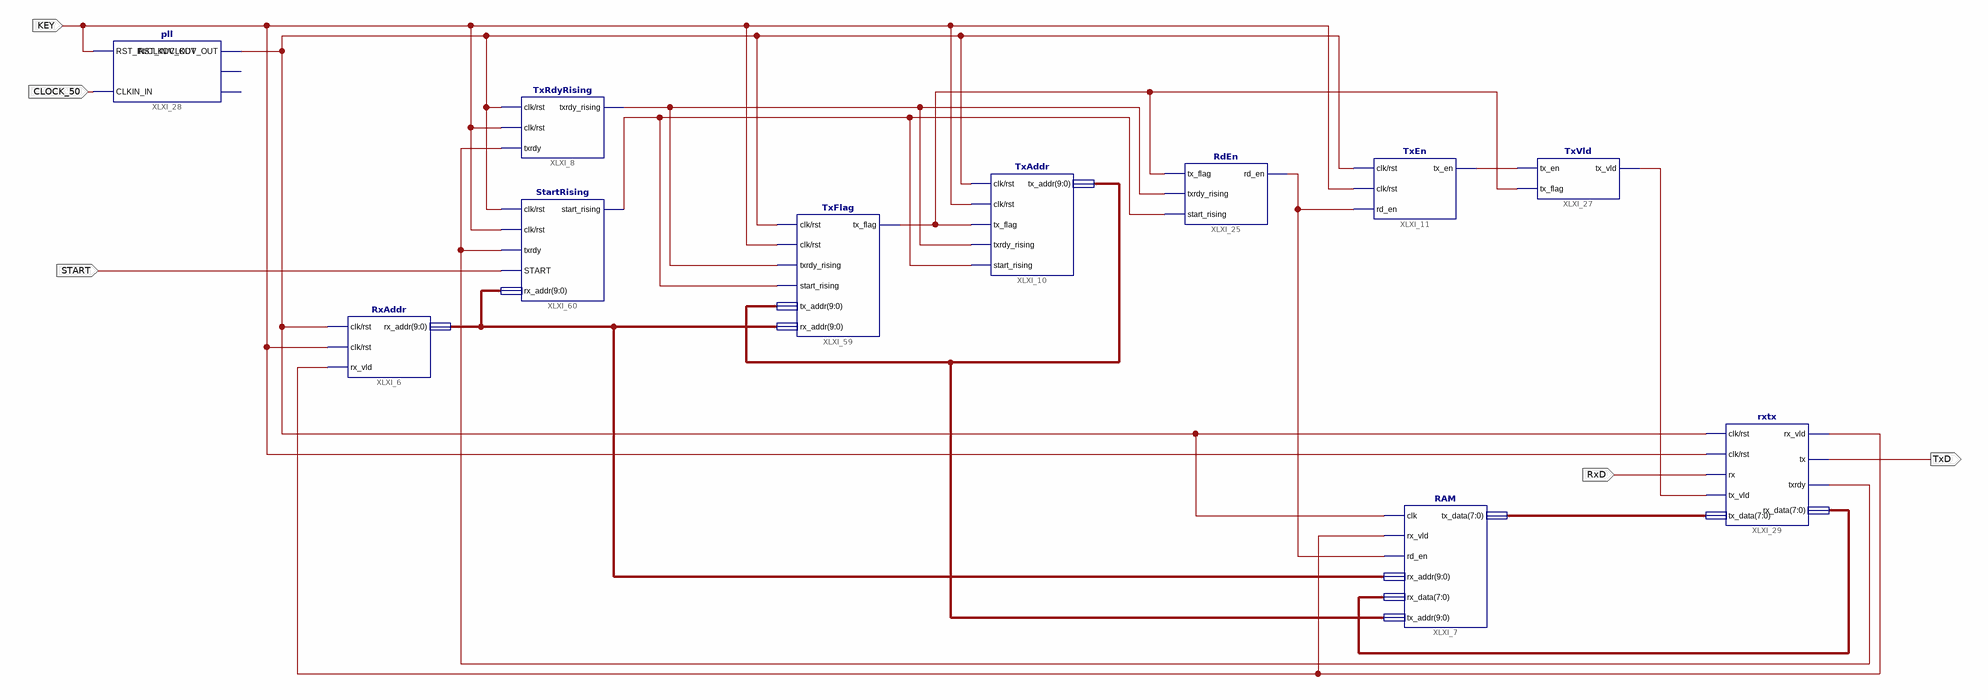
[diagram p0: schematic sheet 1]
// Xilinx ISE schematic uart_x_top.sch (spartan3e) as structural Verilog: 11 symbols, 5 ports
module uart_x_top (
  input  CLOCK_50,
  input  KEY,
  input  START,
  input  RxD,
  output TxD
);

  wire XLXN_12, XLXN_41, XLXN_81, XLXN_87, XLXN_88, XLXN_102, XLXN_172, XLXN_177;
  wire [7:0] XLXN_100, XLXN_108;
  wire [9:0] XLXN_1, XLXN_94;

  TxEn XLXI_11 (.clk(KEY), .rst(KEY), .rd_en(XLXN_87), .tx_en(XLXN_88));
  TxAddr XLXI_10 (
    .clk(KEY), .rst(KEY), .tx_flag(XLXN_177), .txrdy_rising(XLXN_172), .start_rising(XLXN_81),
    .tx_addr(XLXN_94));
  RdEn XLXI_25 (.tx_flag(XLXN_177), .txrdy_rising(XLXN_172), .start_rising(XLXN_81), .rd_en(XLXN_87));
  TxVld XLXI_27 (.tx_en(XLXN_88), .tx_flag(XLXN_177), .tx_vld(XLXN_102));
  pll XLXI_28 (.RST_IN(KEY), .CLKIN_IN(CLOCK_50), .CLKDV_OUT(KEY));  // open: CLKIN_IBUFG_OUT, CLK0_OUT
  RxAddr XLXI_6 (.clk(KEY), .rst(KEY), .rx_vld(XLXN_12), .rx_addr(XLXN_1));
  RAM XLXI_7 (
    .clk(KEY), .rd_en(XLXN_87), .rx_vld(XLXN_12), .rx_data(XLXN_100), .rx_addr(XLXN_1), .tx_addr(XLXN_94),
    .tx_data(XLXN_108));
  TxRdyRising XLXI_8 (.clk(KEY), .rst(KEY), .txrdy(XLXN_41), .txrdy_rising(XLXN_172));
  TxFlag XLXI_59 (
    .clk(KEY), .rst(KEY), .txrdy_rising(XLXN_172), .start_rising(XLXN_81), .tx_addr(XLXN_94),
    .rx_addr(XLXN_1), .tx_flag(XLXN_177));
  StartRising XLXI_60 (.clk(KEY), .rst(KEY), .txrdy(XLXN_41), .START(START), .rx_addr(XLXN_1), .start_rising(XLXN_81));
  rxtx XLXI_29 (
    .clk(KEY), .rst(KEY), .rx(RxD), .tx_vld(XLXN_102), .tx_data(XLXN_108), .rx_vld(XLXN_12), .tx(TxD),
    .txrdy(XLXN_41), .rx_data(XLXN_100));
endmodule
